# EAGLE design keep-it-lit (EAGLE 9.0.1)
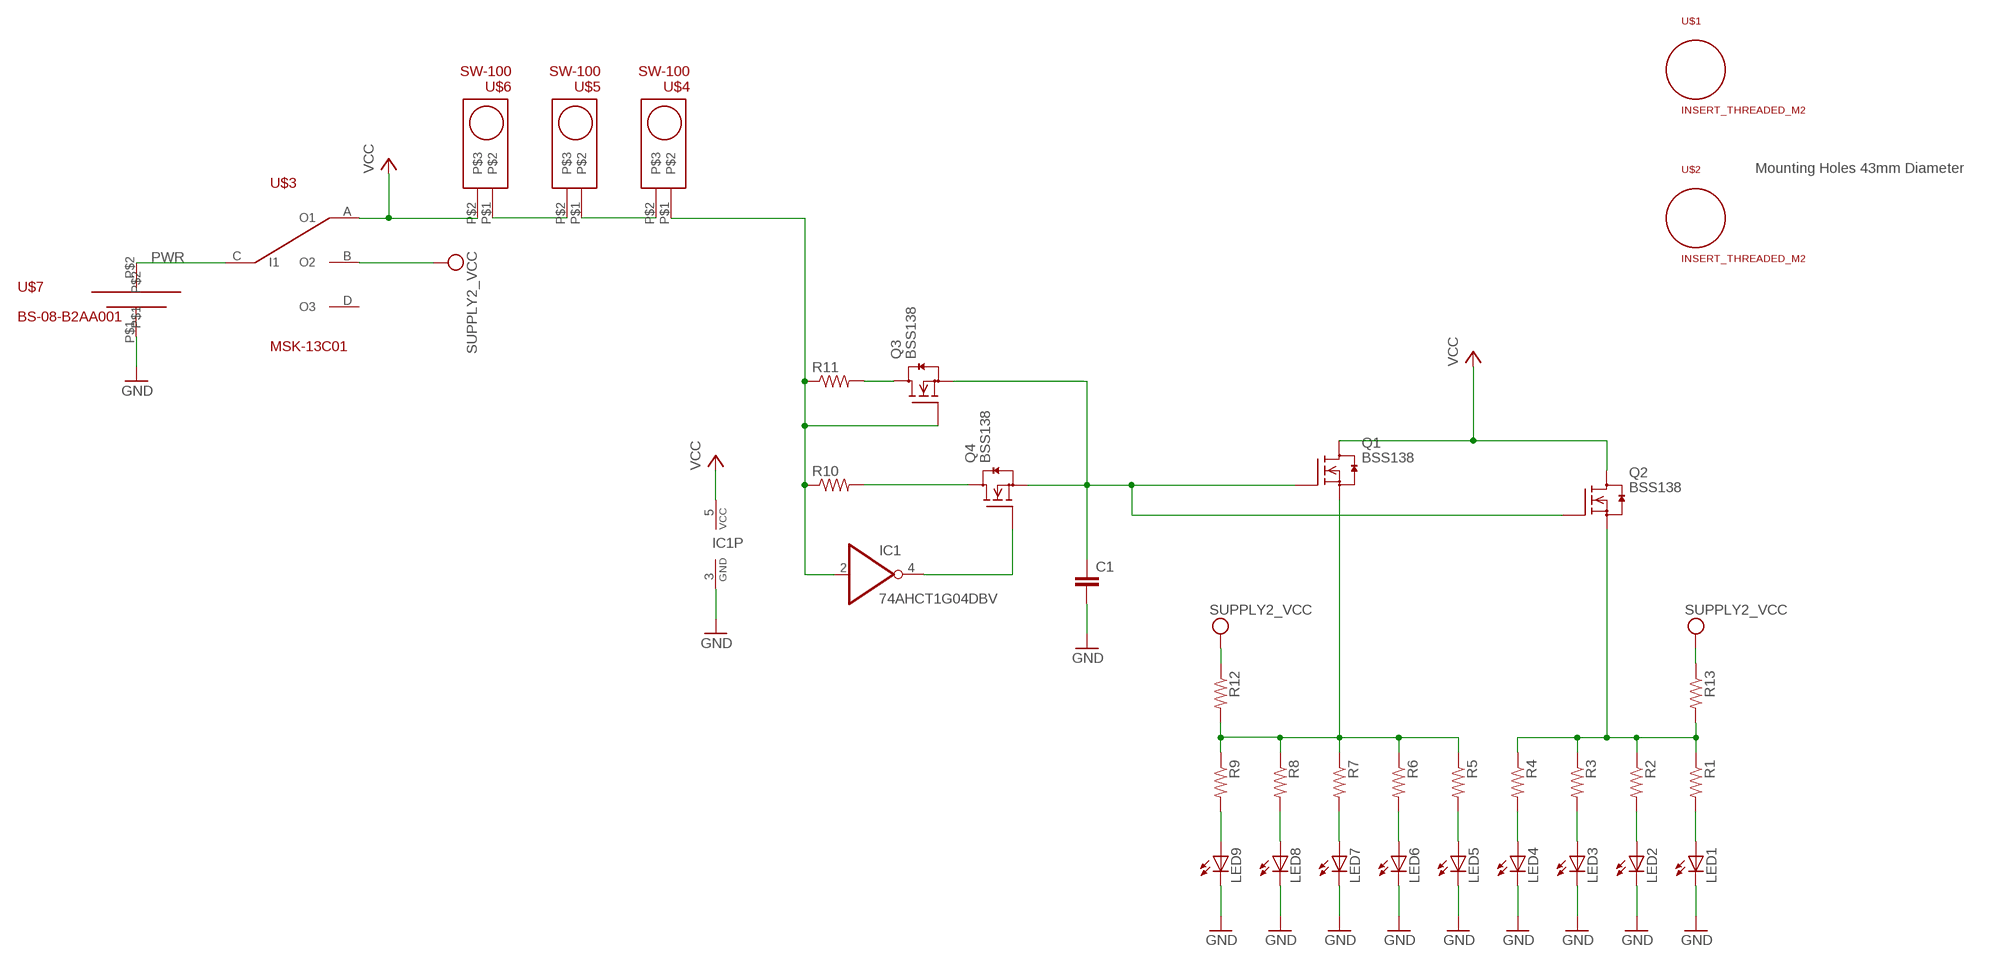
[diagram p0: schematic, sheet 1]

## Parts
C1  CAP0603-CAP  [0603-CAP]
IC1  74AHCT1G04DBV  [SOT23-5]
LED1  LEDCHIPLED_1206  [CHIPLED_1206]
LED2  LEDCHIPLED_1206  [CHIPLED_1206]
LED3  LEDCHIPLED_1206  [CHIPLED_1206]
LED4  LEDCHIPLED_1206  [CHIPLED_1206]
LED5  LEDCHIPLED_1206  [CHIPLED_1206]
LED6  LEDCHIPLED_1206  [CHIPLED_1206]
LED7  LEDCHIPLED_1206  [CHIPLED_1206]
LED8  LEDCHIPLED_1206  [CHIPLED_1206]
LED9  LEDCHIPLED_1206  [CHIPLED_1206]
Q1  BSS138  [SOT23]
Q2  BSS138  [SOT23]
Q3  BSS138  [SOT23]
Q4  BSS138  [SOT23]
R1  RESISTOR0603-RES  [0603-RES]
R2  RESISTOR0603-RES  [0603-RES]
R3  RESISTOR0603-RES  [0603-RES]
R4  RESISTOR0603-RES  [0603-RES]
R5  RESISTOR0603-RES  [0603-RES]
R6  RESISTOR0603-RES  [0603-RES]
R7  RESISTOR0603-RES  [0603-RES]
R8  RESISTOR0603-RES  [0603-RES]
R9  RESISTOR0603-RES  [0603-RES]
R10  RESISTOR0603-RES  [0603-RES]
R11  RESISTOR0603-RES  [0603-RES]
R12  RESISTOR0603-RES  [0603-RES]
R13  RESISTOR0603-RES  [0603-RES]
U$1  INSERT_THREADED_M2  [INSERT_M2]
U$2  INSERT_THREADED_M2  [INSERT_M2]
U$3  MSK-13C01  [SWITCH_SP3T]
U$4  SW-100  [SWITCH_TILT]
U$5  SW-100  [SWITCH_TILT]
U$6  SW-100  [SWITCH_TILT]
U$7  BS-08-B2AA001  [BATTERY_CONNECTOR_CR2032]

## Nets
GND: C1.2 IC1.3(GND) LED1.C LED2.C LED3.C LED4.C LED5.C LED6.C LED7.C LED8.C LED9.C U$7.P$1
LED_GROUP1: Q1.2(S) R5.1 R6.1 R7.1 R8.1 R9.1 R12.2
LED_GROUP2: Q2.2(S) R1.1 R2.1 R3.1 R4.1 R13.2
N$1: LED7.A R7.2
N$2: LED6.A R6.2
N$3: LED5.A R5.2
N$4: LED4.A R4.2
N$5: LED3.A R3.2
N$6: LED2.A R2.2
N$7: LED1.A R1.2
N$9: LED8.A R8.2
N$11: U$4.P$2 U$5.P$1
N$12: U$5.P$2 U$6.P$1
N$13: IC1.2(I) Q3.1(G) R10.1 R11.1 U$4.P$1
N$16: IC1.4(O) Q4.1(G)
N$17: Q3.3(D) R11.2
N$19: Q4.3(D) R10.2
N$21: C1.1 Q1.1(G) Q2.1(G) Q3.2(S) Q4.2(S)
N$22: LED9.A R9.2
PWR: U$3.C(I1) U$7.P$2
VCC: IC1.5(VCC) Q1.3(D) Q2.3(D) U$3.A(O1) U$6.P$2
VCC_ALLON: R12.1 R13.1 U$3.B(O2) ; supply symbol labelled SUPPLY2_VCC
Unconnected: U$3.D(O3)

## Notes on the sheet
- Mounting Holes 43mm Diameter

## Library data of the parts
C1 = SparkFun-Passives:CAP: Capacitor Standard 0603 ceramic capacitor, and 0.1" leaded capacitor.
IC1 = 74xx-little-de:74*1G04: INVERTER Gate
LED1-LED9 = led:LED: LED OSRAM: - CHIPLED LG R971, LG N971, LY N971, LG Q971, LY Q971, LO R971, LY R971 LH N974, LH R974 LS Q976, LO Q976, LY Q976 LO Q996 - Hyper CHIPLED LW Q18S LB Q993, LB Q99A, LB R99A - SideLED LS A670, LO A670, LY A670, LG A670, LP A670 LB A673, LV A673, LT A673, LW A673 LH A674 LY A675 LS A676, LA A676, LO A676, LY A676, LW A676 LS A679, LY A679, LG A679 - Hyper Micro SIDELED® LS Y876, LA Y876, LO Y876, LY Y876 LT Y87S - SmartLED LW L88C, LW L88S LB L89C, LB L89S, LG L890 LS L89K, LO L89K, LY L89K LS L896, LA L896, LO L896, LY L896 - TOPLED LS T670, LO T670, LY T670, LG T670, LP T670 LSG T670, LSP T670, LSY T670, LOP T670, LYG T670 LG T671, LOG T671, LSG T671 LB T673, LV T673, LT T673, LW T673 LH T674 LS T676, LA T676, LO T676, LY T676, LB T676, LH T676, LSB T676, LW T676 LB T67C, LV T67C, LT T67C, LS T67K, LO T67K, LY T67K, LW E67C LS E67B, LA E67B, LO E67B, LY E67B, LB E67C, LV E67C, LT E67C LW T67C LS T679, LY T679, LG T679 LS T770, LO T770, LY T770, LG T770, LP T770 LB T773, LV T773, LT T773, LW T773 LH T774 LS E675, LA E675, LY E675, LS T675 LS T776, LA T776, LO T776, LY T776, LB T776 LHGB T686 LT T68C, LB T68C - Hyper Mini TOPLED® LB M676 - Mini TOPLED Santana® LG M470 LS M47K, LO M47K, LY M47K Source: http://www.osram.convergy.de LUXEON: - LUMILED® LXK2-PW12-R00, LXK2-PW12-S00, LXK2-PW14-U00, LXK2-PW14-V00 LXK2-PM12-R00, LXK2-PM12-S00, LXK2-PM14-U00 LXK2-PE12-Q00, LXK2-PE12-R00, LXK2-PE12-S00, LXK2-PE14-T00, LXK2-PE14-U00 LXK2-PB12-K00, LXK2-PB12-L00, LXK2-PB12-M00, LXK2-PB14-N00, LXK2-PB14-P00, LXK2-PB14-Q00 LXK2-PR12-L00, LXK2-PR12-M00, LXK2-PR14-Q00, LXK2-PR14-R00 LXK2-PD12-Q00, LXK2-PD12-R00, LXK2-PD12-S00 LXK2-PH12-R00, LXK2-PH12-S00 LXK2-PL12-P00, LXK2-PL12-Q00, LXK2-PL12-R00 Source: www.luxeon.com KINGBRIGHT: KA-3528ASYC Source: www.kingbright.com
Q1-Q4 = HQB-partsLED-frisbee:BSS138: Fairchild Semiconductors BSS138 N-Channel Logic Level Enhancement Mode Field Effect Transistor General Description: These N-Channel enhancement mode field effect transistors are produced using Fairchild's proprietary, high cell density, DMOS technology. These products have been designed to minimize on-state resistance while provide rugged, reliable, and fast switching performance.These products are particularly suited for low voltage, low current applications such as small servo motor control, power MOSFET gate drivers, and other switching applications. Features: 0.22 A, 50 V. RDS(ON) = 3.5Ohm @ VGS = 10 V RDS(ON) = 6.0Ohm @ VGS = 4.5 V High density cell design for extremely low RDS(ON) Rugged and Reliable Compact industry standard SOT-23 surface mount package Please send any comments to: messi@users.sourceforge.net
R1-R13 = SparkFun-Passives:RESISTOR: Resistor Basic schematic elements and footprints for 0603, 1206, and PTH resistors.
U$1 U$2 = HQB-partsLED-frisbee:INSERT_THREADED_M2
U$3 = HQB-partsLED-frisbee:MSK-13C01
U$4-U$6 = HQB-partsLED-frisbee:SW-100
U$7 = HQB-partsLED-frisbee:BS-08-B2AA001

## Net classes
1 power: width 0.254 mm, drill 0.35 mm

## Board
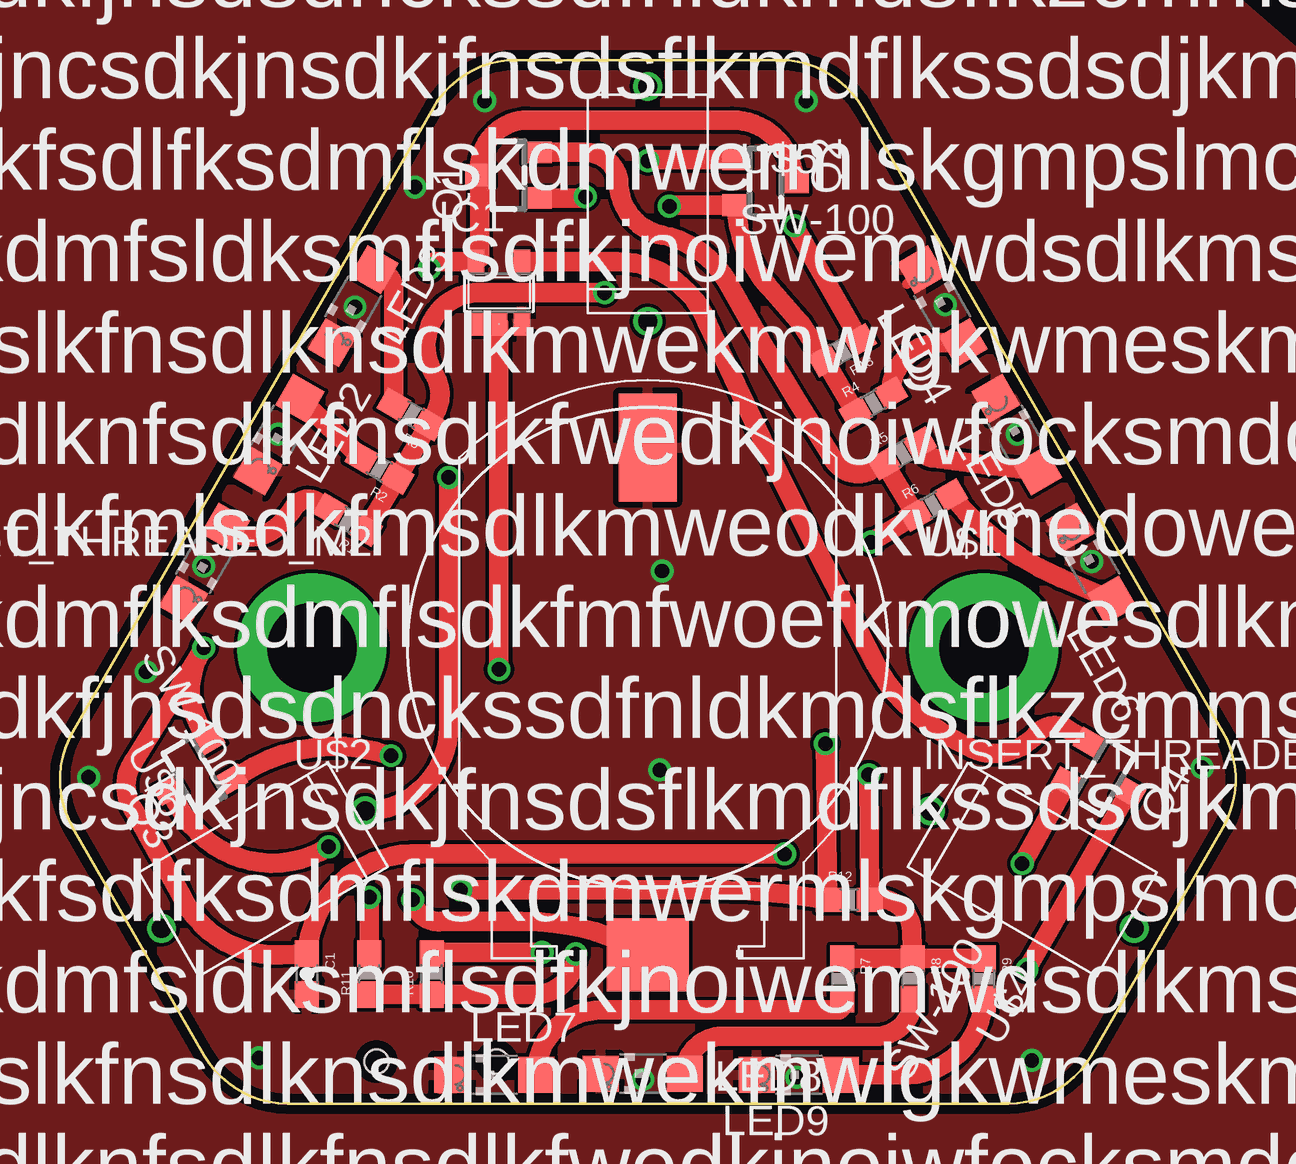
[diagram p1: board, top side]
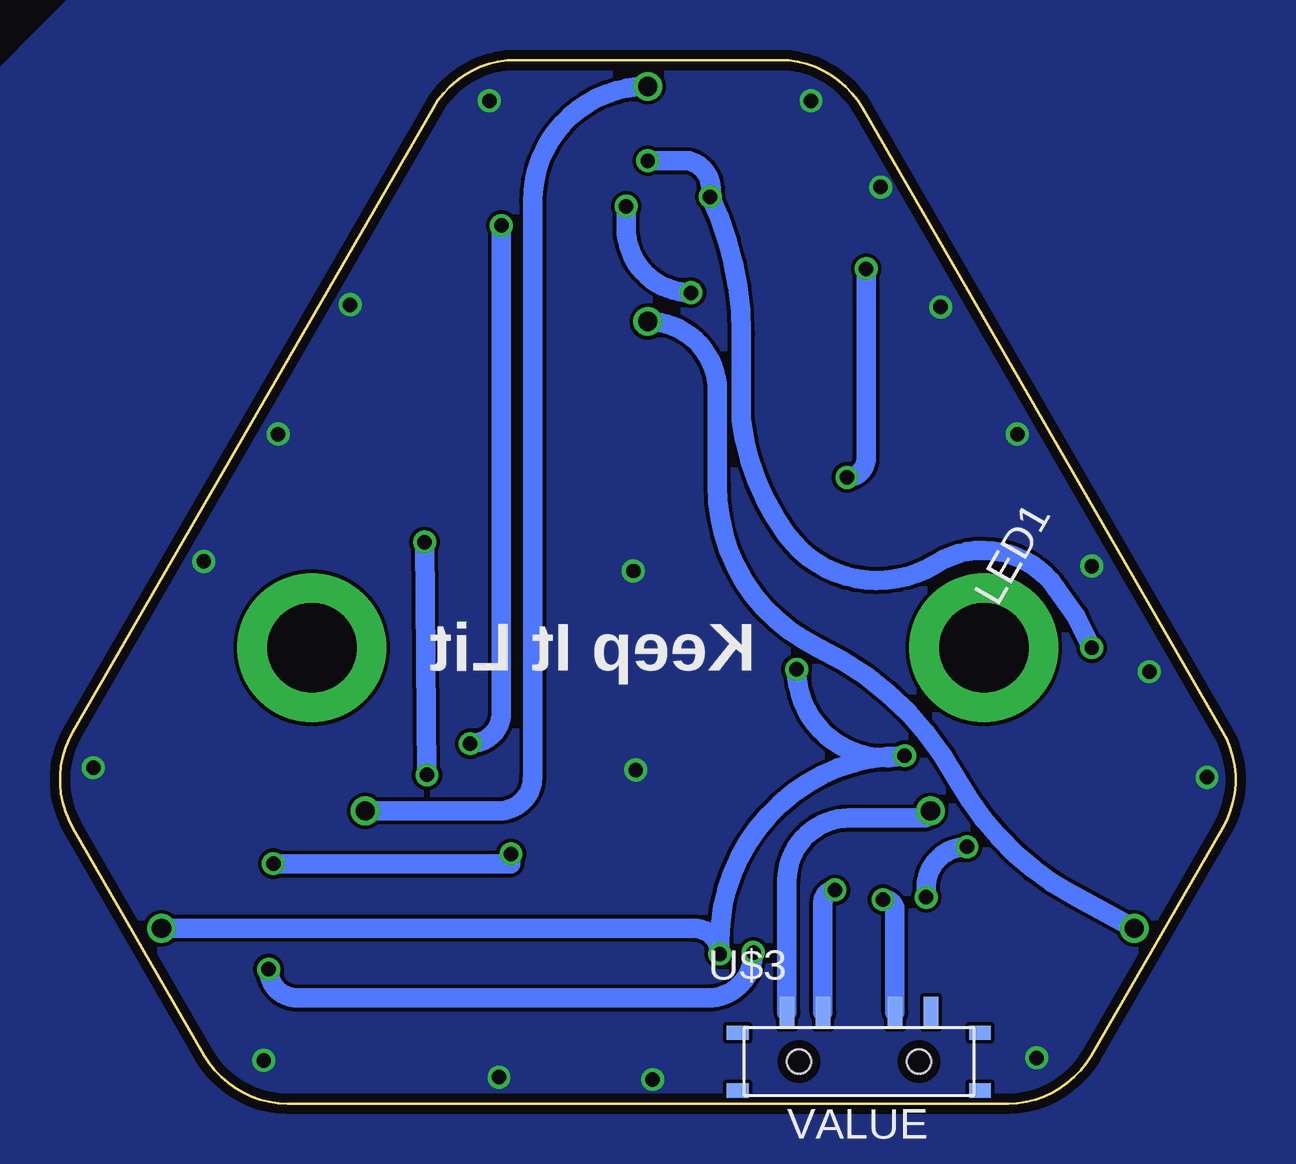
[diagram p2: board, bottom side, seen from below]

Size 48.98 x 43.5 mm. Coordinates in mm from the lower left corner, seen from the top.
Outline: 48.45,15.5 33.44,41.5 arc60 29.98,43.5 19.01,43.5 arc60 15.54,41.5 0.53,15.5 arc60 0.53,11.5 6.02,2 arc60 9.48,0 39.5,0 arc60 42.97,2 48.45,11.5 arc60 48.45,15.5
Copper layers (1*16): Top 0.0356mm / dielectric 1.5011mm / Bottom 0.0356mm
Design rules "oshpark-2layer": minimum track width 6mil, minimum drill 13mil, track to track 6mil, track to pad 6mil, pad to pad 6mil, via to via 6mil, smd to smd 6mil, copper to edge 15mil, drill to drill 6mil, minimum pad ring 7mil, minimum via ring 7mil, stop-mask expansion 2.5mil, vias tented up to drill 0mil, thermal gap 10mil

### Footprints (pad centres in the part's own frame; a part is rotated, then mirrored left to right if it is on the bottom)
0603-CAP = smd 1.1 x 1: 1 -0.85,0; 2 0.85,0
SOT23-5 = smd 0.69 x 0.99: 1 -0.95,-1.29; 2 0,-1.29; 3 0.95,-1.29; 4 0.95,1.3; 5 -0.95,1.3
CHIPLED_1206 = smd 1.5 x 1.5: A 0,-1.75; C 0,1.75
SOT23 = smd 0.9 x 1.2: 1 -0.95,-1.2; 2 0.95,-1.2; 3 0,1.2
0603-RES = smd 1.1 x 1: 1 -0.85,0; 2 0.85,0
INSERT_M2 = drill 3.73 pad 6.2: P$1 0,0
SWITCH_SP3T = smd 0.6 x 1.3: A -3,2.05; B -1.5,2.05; C 1.5,2.05; D 3,2.05 | smd 0.9 x 0.6: P$5 5.05,1.2; P$6 5.05,-1.2; P$7 -5.05,1.2; P$8 -5.05,-1.2 | hole 1: 2.5,0; -2.5,0
SWITCH_TILT = drill 0.8: P$1 0,4.9; P$2 0,-4.9
BATTERY_CONNECTOR_CR2032 = smd 4.5 x 2.4: P$1 -8.35,0 | smd 3.05 x 3.4: P$2 12.803,0

### Placement (x,y rotation side)
C1  10.29,5.4 270 top
IC1  18.29,33.8 0 top
LED1  6.02,22.51 150 top
LED2  9.12,27.88 150 top
LED3  12.22,33.24 150 top
LED4  36.76,33.24 30 top
LED5  39.86,27.88 30 top
LED6  42.96,22.51 30 top
LED7  18.09,1.2 90 top
LED8  24.29,1.25 90 top
LED9  30.79,1.2 90 top
Q1  18.69,38.7 90 top
Q2  29.39,38.4 270 top
Q3  5.59,13.7 120 top
Q4  43.49,13.6 240 top
R1  12,24.33 150 top
R2  13.31,26.49 150 top
R3  14.64,28.72 150 top
R4  33.89,29.2 30 top
R5  35.09,27.1 30 top
R6  36.39,24.95 30 top
R7  32.59,5.2 270 top
R8  35.54,5.2 270 top
R9  38.49,5.2 270 top
R10  15.49,5.4 90 top
R11  12.89,5.4 90 top
R12  32.89,8.5 0 top
R13  32.59,31.4 210 top
U$1  38.49,19 0 top
U$2  10.49,19 180 top
U$3  15.69,1.75 0 bottom
U$4  40.51,9.75 240 top
U$5  24.49,37.5 0 top
U$6  8.47,9.75 120 top
U$7  24.49,19 270 top

### Tracks (layer width: path | path; a pad name or v marks a point on that pad's centre or on a via)
GND  (via drill 0.6)
  Top 0.406: LED4.C 35.29,34.16 | 15.84,0.6 LED7.C
  other vias: 9.09,27.9 12.29,33.2 3.59,18 36.89,33.3 39.89,27.9 42.99,22.6 1.19,13.6 8.29,1.9 47.59,14 31.09,41.8 17.69,41.8 5.99,22.4 14.79,38.2 40.49,1.8 24.29,1 30.69,1.1 25.09,22.2 24.99,13.9
  pour Bottom: -10.51,49 45.49,49 55.69,38.7 55.69,-2.3 45.49,-11 -0.51,-11 -10.51,-1
  pour Top: -10.51,49 -10.51,-6 -0.51,-16 45.49,-16 55.89,-6 55.89,40 45.49,49
LED_GROUP1  (via drill 0.6)
  Top 0.813: Q1.2 21.94,39.65 arc-90 23.29,38.2 arc74 25.09,36.2 arc-48 27.79,34.3 arc4 32.19,26.9 arc91 33.79,26.4 R5.1 R6.1 v33.79,23.4 | R7.1 R8.1 | R8.1 35.49,7.1 arc105 R12.2 | 33.69,8.55 R12.2 | R8.1 R9.1 | R12.2 v33.69,13.7
  Bottom 0.813: v33.69,13.7 v33.79,23.4
LED_GROUP2  (via drill 0.6)
  Top 0.813: R4.1 R13.2 30.89,32.5 29.49,34.1 arc-41 Q2.2 25.44,37.45 arc90 v25.39,37.4 | R1.1 arc1 R2.1 R3.1 arc6 15.69,28.9 arc57 15.59,30.4 arc-128 17.69,33.8 v22.69,33.8
  Bottom 0.813: v22.69,33.8 arc90 25.39,36.5 v25.39,37.4
N$1
  Top 0.813: LED7.A arc-90 22.54,3.9 32.44,3.9 arc90 R7.2
N$2
  Top 0.813: LED6.A 41.69,21.9 arc-29 R6.2
N$3
  Top 0.813: LED5.A 38.79,26.6 36.45,26.9 arc-90 R5.2
N$4
  Top 0.813: LED4.A 36.73,31.72 arc90 R4.2
N$5
  Top 0.813: LED3.A arc-90 13.9,33.95 R3.2
N$6
  Top 0.813: R2.2 LED2.A
N$7
  Top 0.813: R1.2 10.69,25.1 arc87 9.79,24.9 arc-16 8.99,24 arc-82 LED1.A
N$9
  Top 0.813: LED8.A arc-90 27.59,2.8 33.99,2.8 arc90 R8.2
N$11
  Bottom 0.813: U$5.P$1 arc-90 29.29,37.6 29.29,13.6 arc90 30.69,12.2 U$4.P$2
N$12
  Bottom 0.813: U$6.P$1 6.79,8.7 arc33 11.59,13.5 arc-36 17.39,19 arc65 21.59,25.8 21.59,29.7 arc-90 U$5.P$2
N$13  (via drill 0.6)
  Top 0.813: R11.1 R10.1 19.8,4.55 arc90 v21.49,6.24 | Q3.1 7.49,13.7 arc-52 v13.79,14.5 | IC1.2 v18.29,18.1
  Bottom 0.813: U$4.P$1 22.55,7.3 arc90 v21.49,6.24 21.49,6.8 arc90 v13.79,14.5 arc103 v18.29,18.1
N$16
  Top 0.813: IC1.4 23.19,35.1 arc-69 26.99,32.5 arc3 33.99,18.3 arc21 35.49,16.4 arc17 37.99,14.8 arc73 40.69,15.4 arc-81 41.99,15.6 Q4.1
N$17  (via drill 0.6)
  Top 0.813: R11.2 v12.89,8.6 | Q3.3 4.99,12.3 arc94 v11.19,10.7
  Bottom 0.813: v12.89,8.6 12.89,9 arc90 v11.19,10.7
N$19  (via drill 0.6)
  Top 0.813: v40.29,5.6 Q4.3 | v20.09,6.3 15.94,6.3 arc90 R10.2
  Bottom 0.813: v40.29,5.6 arc-90 39.09,4.4 21.99,4.4 arc-90 v20.09,6.3
N$21  (via drill 0.6)
  Top 0.813: Q2.1 24.54,39.35 arc90 v24.49,39.3 | Q4.2 v40.09,10 | v30.19,10.4 15.04,10.4 arc90 C1.1 9.19,6.2 arc-69 4.99,8.8 3.09,12.2 arc-73 3.09,14.3 v5.99,19 arc64 5.79,15.8 Q3.2 | Q1.1 21.84,37.75 v21.89,37.8
  Bottom 0.813: v24.49,39.3 22.79,39.3 arc90 v21.89,37.8 arc26 20.59,32.1 20.59,28.5 arc-29 18.69,23.7 arc-86 12.49,22.5 arc86 7.49,21.5 6.65,20.32 v5.99,19 | v40.09,10 30.19,10 v30.19,10.4
N$22
  Top 0.813: LED9.A 35.04,1.2 arc90 R9.2
PWR  (via drill 0.6)
  Top 0.406: 23.29,7.4 arc-90 U$7.P$2
  Top 0.813: v14.69,8.5 arc90 15.99,7.6 19.19,7.6 arc-31 U$7.P$2
  Bottom 0.813: U$3.C 14.19,8.1 arc-90 v14.69,8.5
VCC  (via drill 0.6)
  Top 0.813: U$6.P$2 arc90 16.19,15.68 v16.19,26.1 | v15.39,34.8 arc-90 15.69,35.1 IC1.5 17.49,35.25 Q1.3 17.49,39 arc-90 19.49,41 27.99,41 arc-90 Q2.3
  Bottom 0.813: v16.19,26.1 arc-90 15.39,26.9 v15.39,34.8 | U$3.A 18.69,9.3 arc90 16.09,11.9 13.02,11.9 arc-90 U$6.P$2
VCC_ALLON  (via drill 0.6)
  Top 0.406: 31.75,8.79 arc-90 R12.1
  Top 0.813: v16.69,8.9 27.09,8.9 arc-9 R12.1 arc-90 31.99,8.55 v31.89,15 | R13.1 v30.59,36.6
  Bottom 0.813: U$3.B 17.19,8.4 arc90 v16.69,8.9 | v30.59,36.6 30.59,16.3 arc90 v31.89,15

### Text on the board
tPlace: sdkfjhsdsdnckssdfnldkmdsflkzcmmsdm / djncsdkjnsdkjfnsdsflkmdflkssdsdjkmks / dkfsdlfksdmflskdmwermlskgmpslmclkm / lkdmfsldksmflsdfkjnoiwemwdsdlkmsdlk / dslkfnsdlknsdlkmwekmwlgkwmeskmerfo / sdlknfsdlkfnsdlkfwedkjnoiwfocksmdoid / lsdkfmlsdkfmsdlkmweodkwmedoweldk / lkdmflksdmflsdkfmfwoefkmowesdlkmdc / sdkfjhsdsdnckssdfnldkmdsflkzcmmsdm / djncsdkjnsdkjfnsdsflkmdflkssdsdjkmks / dkfsdlfksdmflskdmwermlskgmpslmclkm / lkdmfsldksmflsdfkjnoiwemwdsdlkmsdlk / dslkfnsdlknsdlkmwekmwlgkwmeskmerfo / sdlknfsdlkfnsdlkfwedkjnoiwfocksmdoid / lsdkfmlsdkfmsdlkmweodkwmedoweldk / lkdmflksdmflsdkfmfwoefkmowesdlkmdc
bPlace: Keep It Lit